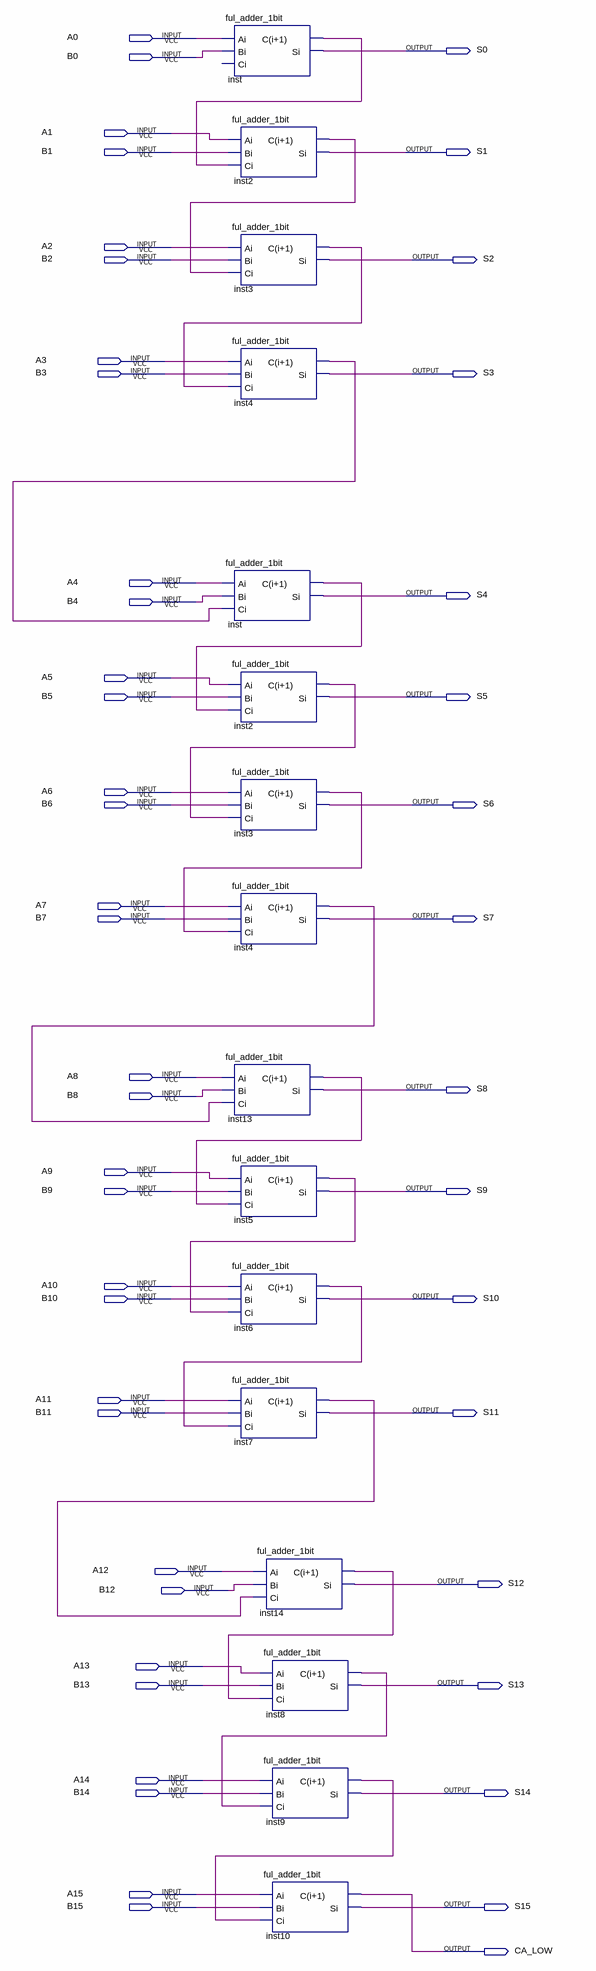
[diagram p0: schematic sheet]
// Quartus schematic 16RCA_LOW.bdf as structural Verilog: 16 symbols, 49 pins
module \16RCA_LOW  (
  input  A0,
  input  B0,
  input  A1,
  input  B1,
  input  A2,
  input  B2,
  input  A3,
  input  B3,
  input  A4,
  input  B4,
  input  A5,
  input  B5,
  input  A6,
  input  B6,
  input  A7,
  input  B7,
  input  A8,
  input  B8,
  input  A9,
  input  B9,
  input  A10,
  input  B10,
  input  A11,
  input  B11,
  input  A12,
  input  B12,
  input  A13,
  input  B13,
  input  A14,
  input  B14,
  input  A15,
  input  B15,
  output S0,
  output S1,
  output S2,
  output S3,
  output S4,
  output S5,
  output S6,
  output S7,
  output S8,
  output S9,
  output S10,
  output S11,
  output S12,
  output S13,
  output S14,
  output S15,
  output CA_LOW
);

  wire inst2_c_i_1_, inst2_c_i_1__2, inst3_c_i_1_, inst3_c_i_1__2, inst4_c_i_1_, inst4_c_i_1__2,
       inst5_c_i_1_, inst6_c_i_1_, inst7_c_i_1_, inst8_c_i_1_, inst9_c_i_1_, inst13_c_i_1_, inst14_c_i_1_,
       inst_c_i_1_, inst_c_i_1__2;

  ful_adder_1bit inst (.Ai(A0), .Bi(B0), .\C(i+1) (inst_c_i_1_), .Si(S0));  // open: Ci
  ful_adder_1bit inst2 (.Ai(A1), .Bi(B1), .Ci(inst_c_i_1_), .\C(i+1) (inst2_c_i_1_), .Si(S1));
  ful_adder_1bit inst3 (.Ai(A2), .Bi(B2), .Ci(inst2_c_i_1_), .\C(i+1) (inst3_c_i_1_), .Si(S2));
  ful_adder_1bit inst4 (.Ai(A3), .Bi(B3), .Ci(inst3_c_i_1_), .\C(i+1) (inst4_c_i_1_), .Si(S3));
  ful_adder_1bit inst_dup2 (.Ai(A4), .Bi(B4), .Ci(inst4_c_i_1_), .\C(i+1) (inst_c_i_1__2), .Si(S4));
  ful_adder_1bit inst2_dup2 (.Ai(A5), .Bi(B5), .Ci(inst_c_i_1__2), .\C(i+1) (inst2_c_i_1__2), .Si(S5));
  ful_adder_1bit inst3_dup2 (.Ai(A6), .Bi(B6), .Ci(inst2_c_i_1__2), .\C(i+1) (inst3_c_i_1__2), .Si(S6));
  ful_adder_1bit inst4_dup2 (.Ai(A7), .Bi(B7), .Ci(inst3_c_i_1__2), .\C(i+1) (inst4_c_i_1__2), .Si(S7));
  ful_adder_1bit inst13 (.Ai(A8), .Bi(B8), .Ci(inst4_c_i_1__2), .\C(i+1) (inst13_c_i_1_), .Si(S8));
  ful_adder_1bit inst5 (.Ai(A9), .Bi(B9), .Ci(inst13_c_i_1_), .\C(i+1) (inst5_c_i_1_), .Si(S9));
  ful_adder_1bit inst6 (.Ai(A10), .Bi(B10), .Ci(inst5_c_i_1_), .\C(i+1) (inst6_c_i_1_), .Si(S10));
  ful_adder_1bit inst7 (.Ai(A11), .Bi(B11), .Ci(inst6_c_i_1_), .\C(i+1) (inst7_c_i_1_), .Si(S11));
  ful_adder_1bit inst14 (.Ai(A12), .Bi(B12), .Ci(inst7_c_i_1_), .\C(i+1) (inst14_c_i_1_), .Si(S12));
  ful_adder_1bit inst8 (.Ai(A13), .Bi(B13), .Ci(inst14_c_i_1_), .\C(i+1) (inst8_c_i_1_), .Si(S13));
  ful_adder_1bit inst9 (.Ai(A14), .Bi(B14), .Ci(inst8_c_i_1_), .\C(i+1) (inst9_c_i_1_), .Si(S14));
  ful_adder_1bit inst10 (.Ai(A15), .Bi(B15), .Ci(inst9_c_i_1_), .\C(i+1) (CA_LOW), .Si(S15));
endmodule
